# EAGLE design CarPreamp (EAGLE 7.6.0)
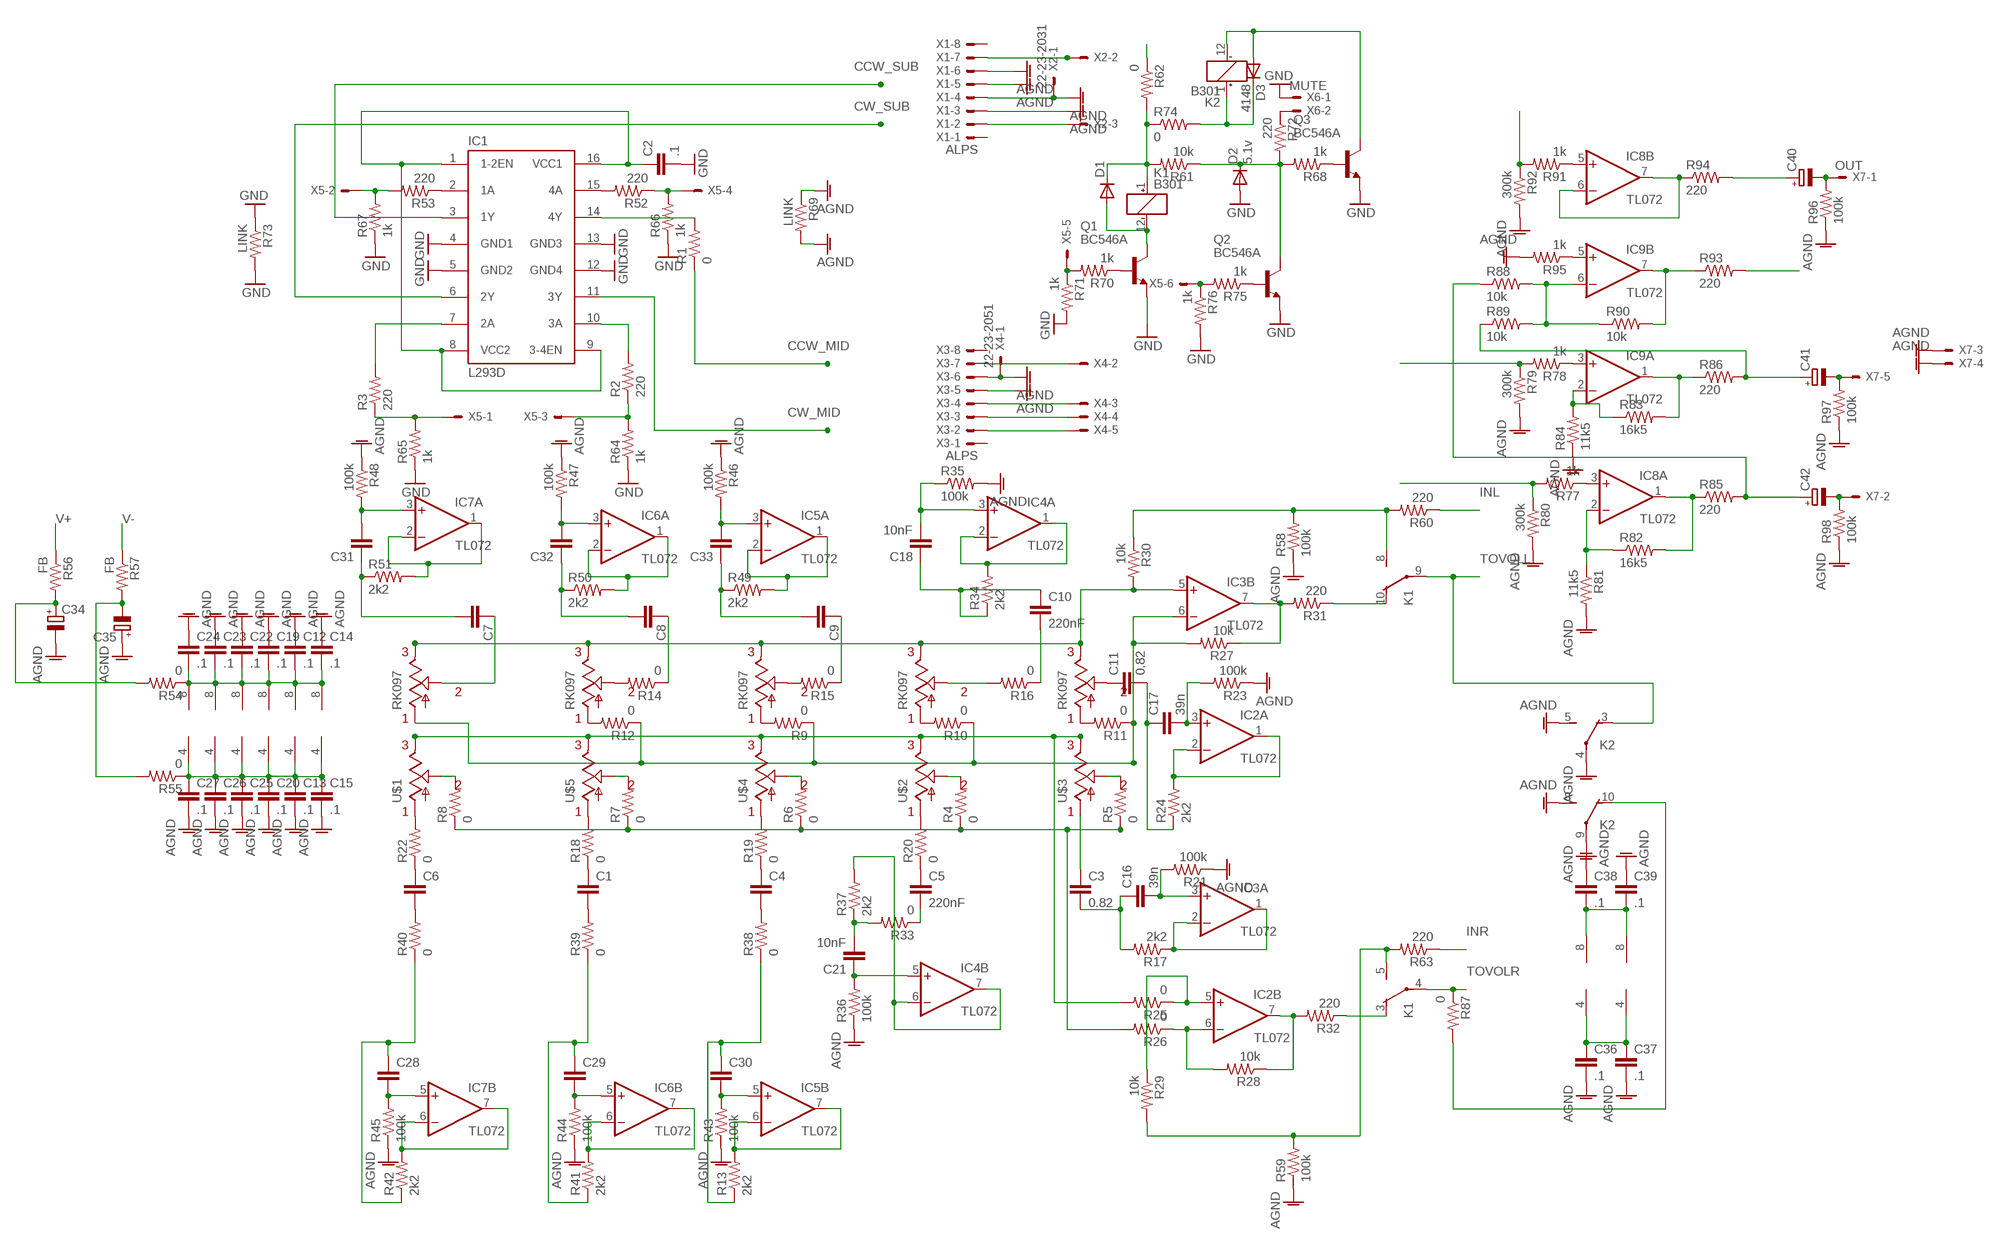
[diagram p0: schematic, sheet 1]

## Parts
C1  C-EU050-035X075  [C050-035X075]
C2  .1  C-EUC1210  [C1210]
C3  0.82  C-EU075-032X103  [C075-032X103]
C4  C-EU050-035X075  [C050-035X075]
C5  220nF  C-EU050-035X075  [C050-035X075]
C6  C-EU050-035X075  [C050-035X075]
C7  C-EU050-035X075  [C050-035X075]
C8  C-EU050-035X075  [C050-035X075]
C9  C-EU050-035X075  [C050-035X075]
C10  220nF  C-EU050-035X075  [C050-035X075]
C11  0.82  C-EU075-032X103  [C075-032X103]
C12  .1  C-EUC1210  [C1210]
C13  .1  C-EUC1210  [C1210]
C14  .1  C-EUC1210  [C1210]
C15  .1  C-EUC1210  [C1210]
C16  39n  C-EU050-035X075  [C050-035X075]
C17  39n  C-EU050-035X075  [C050-035X075]
C18  10nF  C-EU050-035X075  [C050-035X075]
C19  .1  C-EUC1210  [C1210]
C20  .1  C-EUC1210  [C1210]
C21  10nF  C-EU050-035X075  [C050-035X075]
C22  .1  C-EUC1210  [C1210]
C23  .1  C-EUC1210  [C1210]
C24  .1  C-EUC1210  [C1210]
C25  .1  C-EUC1210  [C1210]
C26  .1  C-EUC1210  [C1210]
C27  .1  C-EUC1210  [C1210]
C28  C-EU050-035X075  [C050-035X075]
C29  C-EU050-035X075  [C050-035X075]
C30  C-EU050-035X075  [C050-035X075]
C31  C-EU050-035X075  [C050-035X075]
C32  C-EU050-035X075  [C050-035X075]
C33  C-EU050-035X075  [C050-035X075]
C34  CPOL-EUE3.5-8  [E3,5-8]
C35  CPOL-EUE3.5-8  [E3,5-8]
C36  .1  C-EUC1210  [C1210]
C37  .1  C-EUC1210  [C1210]
C38  .1  C-EUC1210  [C1210]
C39  .1  C-EUC1210  [C1210]
C40  CPOL-EUE3.5-8  [E3,5-8]
C41  CPOL-EUE3.5-8  [E3,5-8]
C42  CPOL-EUE3.5-8  [E3,5-8]
D1  1N4148DO35-10  [DO35-10]
D2  5.1v  1N4148DO35-10  [DO35-10]
D3  4148  1N4148DO35-10  [DO35-10]
IC1  L293D  [DIL16]
IC2  TL072  LM1458N  [DIL08]
IC3  TL072  LM1458N  [DIL08]
IC4  TL072  LM1458N  [DIL08]
IC5  TL072  LM1458N  [DIL08]
IC6  TL072  LM1458N  [DIL08]
IC7  TL072  LM1458N  [DIL08]
IC8  TL072  LM1458N  [DIL08]
IC9  TL072  LM1458N  [DIL08]
K1  B301  TXD2-6V  [TXD2]
K2  B301  TXD2-6V  [TXD2]
Q1  BC546A  [TO92-EBC]
Q2  BC546A  [TO92-EBC]
Q3  BC546A  [TO92-EBC]
R1  0  R-US_0309/12  [0309/12]
R2  220  R-US_0309/12  [0309/12]
R3  220  R-US_0207/15  [0207/15]
R4  0  R-US_0207/7  [0207/7]
R5  0  R-US_0207/7  [0207/7]
R6  0  R-US_0207/7  [0207/7]
R7  0  R-US_0207/7  [0207/7]
R8  0  R-US_0207/7  [0207/7]
R9  0  R-US_0207/7  [0207/7]
R10  0  R-US_0207/7  [0207/7]
R11  0  R-US_0207/7  [0207/7]
R12  0  R-US_0207/7  [0207/7]
R13  2k2  R-US_0207/7  [0207/7]
R14  0  R-US_0207/7  [0207/7]
R15  0  R-US_0207/7  [0207/7]
R16  0  R-US_0207/7  [0207/7]
R17  2k2  R-US_0207/7  [0207/7]
R18  0  R-US_0207/7  [0207/7]
R19  0  R-US_0207/7  [0207/7]
R20  0  R-US_0207/7  [0207/7]
R21  100k  R-US_0207/7  [0207/7]
R22  0  R-US_0207/7  [0207/7]
R23  100k  R-US_0207/7  [0207/7]
R24  2k2  R-US_0207/7  [0207/7]
R25  0  R-US_0207/10  [0207/10]
R26  0  R-US_0207/12  [0207/12]
R27  10k  R-US_R1210  [R1210]
R28  10k  R-US_R1210  [R1210]
R29  10k  R-US_0207/7  [0207/7]
R30  10k  R-US_0207/12  [0207/12]
R31  220  R-US_0207/7  [0207/7]
R32  220  R-US_0207/12  [0207/12]
R33  0  R-US_0309/10  [0309/10]
R34  2k2  R-US_0207/7  [0207/7]
R35  100k  R-US_0207/7  [0207/7]
R36  100k  R-US_0207/7  [0207/7]
R37  2k2  R-US_0207/7  [0207/7]
R38  0  R-US_0207/10  [0207/10]
R39  0  R-US_0207/10  [0207/10]
R40  0  R-US_0207/10  [0207/10]
R41  2k2  R-US_0207/7  [0207/7]
R42  2k2  R-US_0207/7  [0207/7]
R43  100k  R-US_0207/7  [0207/7]
R44  100k  R-US_0207/7  [0207/7]
R45  100k  R-US_0207/7  [0207/7]
R46  100k  R-US_0207/7  [0207/7]
R47  100k  R-US_0207/7  [0207/7]
R48  100k  R-US_0207/7  [0207/7]
R49  2k2  R-US_0207/7  [0207/7]
R50  2k2  R-US_0207/7  [0207/7]
R51  2k2  R-US_0207/7  [0207/7]
R52  220  R-US_0309/10  [0309/10]
R53  220  R-US_0309/10  [0309/10]
R54  0  R-US_0309/10  [0309/10]
R55  0  R-US_0411/15  [0411/15]
R56  FB  R-US_0309/12  [0309/12]
R57  FB  R-US_0309/12  [0309/12]
R58  100k  R-US_0207/7  [0207/7]
R59  100k  R-US_0207/7  [0207/7]
R60  220  R-US_0207/7  [0207/7]
R61  10k  R-US_R1210  [R1210]
R62  0  R-US_0309/10  [0309/10]
R63  220  R-US_0207/7  [0207/7]
R64  1k  R-US_R1210  [R1210]
R65  1k  R-US_R1210  [R1210]
R66  1k  R-US_R1210  [R1210]
R67  1k  R-US_R1210  [R1210]
R68  1k  R-US_R1210  [R1210]
R69  LINK  R-US_0309/12  [0309/12]
R70  1k  R-US_R1210  [R1210]
R71  1k  R-US_R1210  [R1210]
R72  220  R-US_R1210  [R1210]
R73  LINK  R-US_0309/10  [0309/10]
R74  0  R-US_0309/12  [0309/12]
R75  1k  R-US_0309/10  [0309/10]
R76  1k  R-US_0309/10  [0309/10]
R77  1k  R-US_0207/7  [0207/7]
R78  1k  R-US_0207/7  [0207/7]
R79  300k  R-US_0207/7  [0207/7]
R80  300k  R-US_0207/7  [0207/7]
R81  11k5  R-US_0207/7  [0207/7]
R82  16k5  R-US_0207/7  [0207/7]
R83  16k5  R-US_0207/7  [0207/7]
R84  11k5  R-US_0207/7  [0207/7]
R85  220  R-US_0207/7  [0207/7]
R86  220  R-US_0207/7  [0207/7]
R87  0  R-US_0207/10  [0207/10]
R88  10k  R-US_0207/7  [0207/7]
R89  10k  R-US_0207/7  [0207/7]
R90  10k  R-US_0207/7  [0207/7]
R91  1k  R-US_0207/7  [0207/7]
R92  300k  R-US_0207/7  [0207/7]
R93  220  R-US_0207/7  [0207/7]
R94  220  R-US_0207/7  [0207/7]
R95  1k  R-US_0207/10  [0207/10]
R96  100k  R-US_0207/7  [0207/7]
R97  100k  R-US_0207/7  [0207/7]
R98  100k  R-US_0207/7  [0207/7]
U$1  RK097  RK097-DUAL-ELEMENT  [RK097-DUAL-ELEMENT]
U$2  RK097  RK097-DUAL-ELEMENT  [RK097-DUAL-ELEMENT]
U$3  RK097  RK097-DUAL-ELEMENT  [RK097-DUAL-ELEMENT]
U$4  RK097  RK097-DUAL-ELEMENT  [RK097-DUAL-ELEMENT]
U$5  RK097  RK097-DUAL-ELEMENT  [RK097-DUAL-ELEMENT]
X1  ALPS  22-23-2081  [22-23-2081]
X2  22-23-2031  [22-23-2031]
X3  ALPS  22-23-2081  [22-23-2081]
X4  22-23-2051  [22-23-2051]
X5  22-23-2061  [22-23-2061]
X6  MUTE  22-23-2021  [22-23-2021]
X7  OUT  22-23-2051  [22-23-2051]

## Nets
5V: C2.1 IC1.1(1-2EN) IC1.8(VCC2) IC1.9(3-4EN) IC1.16(VCC1) R62.1
AGND: C12.1 C13.2 C14.1 C15.2 C19.1 C20.2 C22.1 C23.1 C24.1 C25.2 C26.2 C27.2 C34.- C35.+ C36.2 C37.2 C38.1 C39.1 K2.4(P) K2.5(S) K2.8(S) K2.9(P) R21.1 R23.1 R35.2 R36.1 R43.1 R44.1 R45.1 R46.1 R47.1 R48.1 R58.1 R59.1 R69.1 R69.2 R79.2 R80.2 R81.2 R84.1 R92.2 R95.2 R96.1 R97.1 R98.1 X1.3 X1.4 X1.5 X1.6 X2.1 X3.5 X3.6 X4.1 X7.3 X7.4
CCW_MID: R1.1
CCW_SUB: IC1.3(1Y)
CW_MID: IC1.11(3Y)
CW_SUB: IC1.6(2Y)
GND: C2.2 D2.A IC1.4(GND1) IC1.5(GND2) IC1.12(GND4) IC1.13(GND3) Q1.E Q2.E Q3.E R64.1 R65.1 R66.1 R67.1 R71.2 R73.1 R73.2 R76.2 X6.1
INL: R60.1
INR: R63.1
N$2: IC1.14(4Y) R1.2
N$4: X3.2 X4.5
N$6: X3.3 X4.4
N$7: IC1.7(2A) R3.2
N$8: IC1.15(4A) R52.2
N$10: X1.2 X2.3
N$11: X1.7 X2.2
N$12: IC1.10(3A) R2.2
N$13: X3.7 X4.2
N$14: R25.2 U$1.P$4(E1) U$2.P$4(E1) U$3.P$4(E1) U$4.P$4(E1) U$5.P$4(E1)
N$15: IC3.5(B:+IN) R30.2 U$1.P$3(E) U$2.P$3(E) U$3.P$3(E) U$4.P$3(E) U$5.P$3(E)
N$16: X3.4 X4.3
N$17: R5.2 U$3.P$6(S1)
N$18: R6.2 U$4.P$6(S1)
N$19: R7.2 U$5.P$6(S1)
N$20: R8.2 U$1.P$6(S1)
N$21: R4.1 R5.1 R6.1 R7.1 R8.1 R26.2
N$22: R16.2 U$2.P$5(S)
N$23: R4.2 U$2.P$6(S1)
N$24: R9.2 U$4.P$1(A)
N$25: R10.2 U$2.P$1(A)
N$26: R11.2 U$3.P$1(A)
N$27: R12.2 U$5.P$1(A)
N$28: IC7.6(B:-IN) IC7.7(B:OUT) R42.2
N$29: IC3.6(B:-IN) R9.1 R10.1 R11.1 R12.1 R27.2 U$1.P$1(A)
N$30: R14.2 U$5.P$5(S)
N$31: R15.2 U$4.P$5(S)
N$32: C11.1 U$3.P$5(S)
N$33: R18.2 U$5.P$2(A1)
N$34: R19.2 U$4.P$2(A1)
N$35: R20.2 U$2.P$2(A1)
N$36: C3.1 U$3.P$2(A1)
N$37: R22.2 U$1.P$2(A1)
N$42: C1.1 R18.1
N$43: IC6.6(B:-IN) IC6.7(B:OUT) R41.2
N$44: C4.1 R19.1
N$45: C5.1 R20.1
N$46: C6.1 R22.1
N$47: C7.1 U$1.P$5(S)
N$48: C8.1 R14.1
N$49: C9.1 R15.1
N$50: C10.2 R16.1
N$51: IC5.6(B:-IN) IC5.7(B:OUT) R13.2
N$52: IC2.5(B:+IN) R25.1 R29.1
N$53: IC2.6(B:-IN) R26.1 R28.2
N$54: IC3.7(B:OUT) R27.1 R31.2
N$55: IC2.7(B:OUT) R28.1 R32.2
N$56: IC4.1(A:OUT) IC4.2(A:-IN) R34.2
N$57: C10.1 C18.1 R34.1
N$58: IC4.6(B:-IN) IC4.7(B:OUT) R37.2
N$59: IC2.1(A:OUT) IC2.2(A:-IN) R24.2
N$60: IC3.1(A:OUT) IC3.2(A:-IN) R17.1
N$61: C16.2 IC3.3(A:+IN) R21.2
N$62: C3.2 C16.1 R17.2
N$63: C17.2 IC2.3(A:+IN) R23.2
N$64: C11.2 C17.1 R24.1
N$65: C5.2 R33.1
N$66: C18.2 IC4.3(A:+IN) R35.1
N$67: C21.2 R33.2 R37.1
N$68: C21.1 IC4.5(B:+IN) R36.2
N$69: C12.2 C14.2 C19.2 C22.2 C23.2 C24.2 IC2.8(P:V+) IC3.8(P:V+) IC4.8(P:V+) IC5.8(P:V+) IC6.8(P:V+) IC7.8(P:V+) R54.1
N$70: C28.2 IC7.5(B:+IN) R45.2
N$71: C29.2 IC6.5(B:+IN) R44.2
N$72: C30.2 IC5.5(B:+IN) R43.2
N$73: C28.1 R40.1 R42.1
N$74: C13.1 C15.1 C20.1 C25.1 C26.1 C27.1 IC2.4(P:V-) IC3.4(P:V-) IC4.4(P:V-) IC5.4(P:V-) IC6.4(P:V-) IC7.4(P:V-) R55.1
N$75: C4.2 R38.2
N$76: C1.2 R39.2
N$77: C6.2 R40.2
N$78: C29.1 R39.1 R41.1
N$79: C30.1 R13.1 R38.1
N$80: IC7.1(A:OUT) IC7.2(A:-IN) R51.2
N$81: IC6.1(A:OUT) IC6.2(A:-IN) R50.2
N$82: IC5.1(A:OUT) IC5.2(A:-IN) R49.2
N$83: C7.2 C31.1 R51.1
N$84: C8.2 C32.1 R50.1
N$85: C9.2 C33.1 R49.1
N$86: C31.2 IC7.3(A:+IN) R48.2
N$87: C32.2 IC6.3(A:+IN) R47.2
N$88: C33.2 IC5.3(A:+IN) R46.2
N$89: IC1.2(1A) R53.1
N$90: Q1.B R70.1
N$91: R70.2 R71.1 X5.5
N$92: K1.10(O) R31.1
N$93: K1.8(S) R30.1 R58.2 R60.2
N$94: K1.5(S) R29.2 R59.2 R63.2
N$95: K1.3(O) R32.1
N$96: R3.1 R65.2 X5.1
N$97: R2.1 R64.2 X5.3
N$98: D1.C K1.1(_:+) R61.2 R62.2 R74.1
N$99: D1.A K1.12(_:-) Q1.C
N$100: R52.1 R66.2 X5.4
N$101: R53.2 R67.2 X5.2
N$104: D2.C Q2.C R61.1 R68.2 R72.2
N$105: Q2.B R75.1
N$106: R75.2 R76.1 X5.6
N$107: Q3.B R68.1
N$108: R72.1 X6.2
N$109: D3.C K2.1(_:+) R74.2
N$110: D3.A K2.12(_:-) Q3.C
N$111: C38.2 C39.2 IC8.8(P:V+) IC9.8(P:V+)
N$112: C36.1 C37.1 IC8.4(P:V-) IC9.4(P:V-)
N$113: IC9.1(A:OUT) R83.2 R86.1
N$114: IC8.1(A:OUT) R82.2 R85.1
N$115: IC8.6(B:-IN) IC8.7(B:OUT) R94.1
N$116: IC9.7(B:OUT) R90.2 R93.1
N$117: IC8.3(A:+IN) R77.1
N$118: IC9.3(A:+IN) R78.1
N$119: R78.2 R79.1
N$120: R77.2 R80.1
N$121: IC9.2(A:-IN) R83.1 R84.2
N$122: IC8.2(A:-IN) R81.1 R82.1
N$123: IC9.6(B:-IN) R88.2 R89.2 R90.1
N$124: K2.10(O) R87.2
N$125: IC8.5(B:+IN) R91.1
N$126: R91.2 R92.1
N$127: IC9.5(B:+IN) R95.1
N$128: C41.+ R86.2 R89.1
N$129: C42.+ R85.2 R88.1
N$130: C40.+ R94.2
N$131: R93.2
N$132: C40.- R96.2 X7.1
N$133: C41.- R97.2 X7.5
N$134: C42.- R98.2 X7.2
TOVOLL: K1.9(P) K2.3(O)
TOVOLR: K1.4(P) R87.1
V+: R56.1
V++: C34.+ R54.2 R56.2
V-: R57.1
V--: C35.- R55.2 R57.2
Unconnected: X1.1 X1.8 X3.1 X3.8

## Library data of the parts
C1-C33 C36-C39 = resistor:C-EU: CAPACITOR, European symbol
C34 C35 C40-C42 = resistor:CPOL-EU: POLARIZED CAPACITOR, European symbol
D1-D3 = diode:1N4148: DIODE high speed (Philips)
IC1 = st-microelectronics:L293D: PUSH-PULL 4 CHANNEL DRIVER; MPN: L293D; OC_FARNELL: 9589619; OC_NEWARK: 56P8249
IC2-IC9 = linear:*1458: OP AMP
K1 K2 = relay:TX?-*: TX Relais NAiS TX-D RELAYS HIGH INSULATION Conforming to the supplementary insulation class of EN Standards (EN41003) Source: http://www.mew-europe.com/.. en_ds_61022_0007.pdf TX-S RELAYS SMALL POLARIZED RELAY WITH HIGH SENSITIVITY 50mW Source: http://www.mew-europe.com/.. en_ds_61022_0022.pdf; OC_FARNELL: unknown; OC_NEWARK: unknown
Q1-Q3 = transistor-npn:BC546*: NPN Transistor
R1-R98 = resistor:R-US_: RESISTOR, American symbol
U$1-U$5 = alps_japan_potentiometers:RK097-DUAL-ELEMENT: SCHEMATIC FOR DUAL POTENTIOMETER
X1 X3 = con-molex:22-23-2081: .100" (2.54mm) Center Header - 8 Pin; MF: MOLEX; MPN: 22-23-2081; OC_FARNELL: 1756826; OC_NEWARK: 01C7592
X2 = con-molex:22-23-2031: .100" (2.54mm) Center Header - 3 Pin; MF: MOLEX; MPN: 22-23-2031; OC_FARNELL: 1462950; OC_NEWARK: 30C0862
X4 X7 = con-molex:22-23-2051: .100" (2.54mm) Center Header - 5 Pin; MF: MOLEX; MPN: 22-23-2051; OC_FARNELL: 1462952; OC_NEWARK: 38C9178
X5 = con-molex:22-23-2061: .100" (2.54mm) Center Header - 6 Pin; MF: MOLEX; MPN: 22-23-2061; OC_FARNELL: 1462922; OC_NEWARK: 27C1933
X6 = con-molex:22-23-2021: .100" (2.54mm) Center Header - 2 Pin; MF: MOLEX; MPN: 22-23-2021; OC_FARNELL: 1462926; OC_NEWARK: 25C3832

## Board
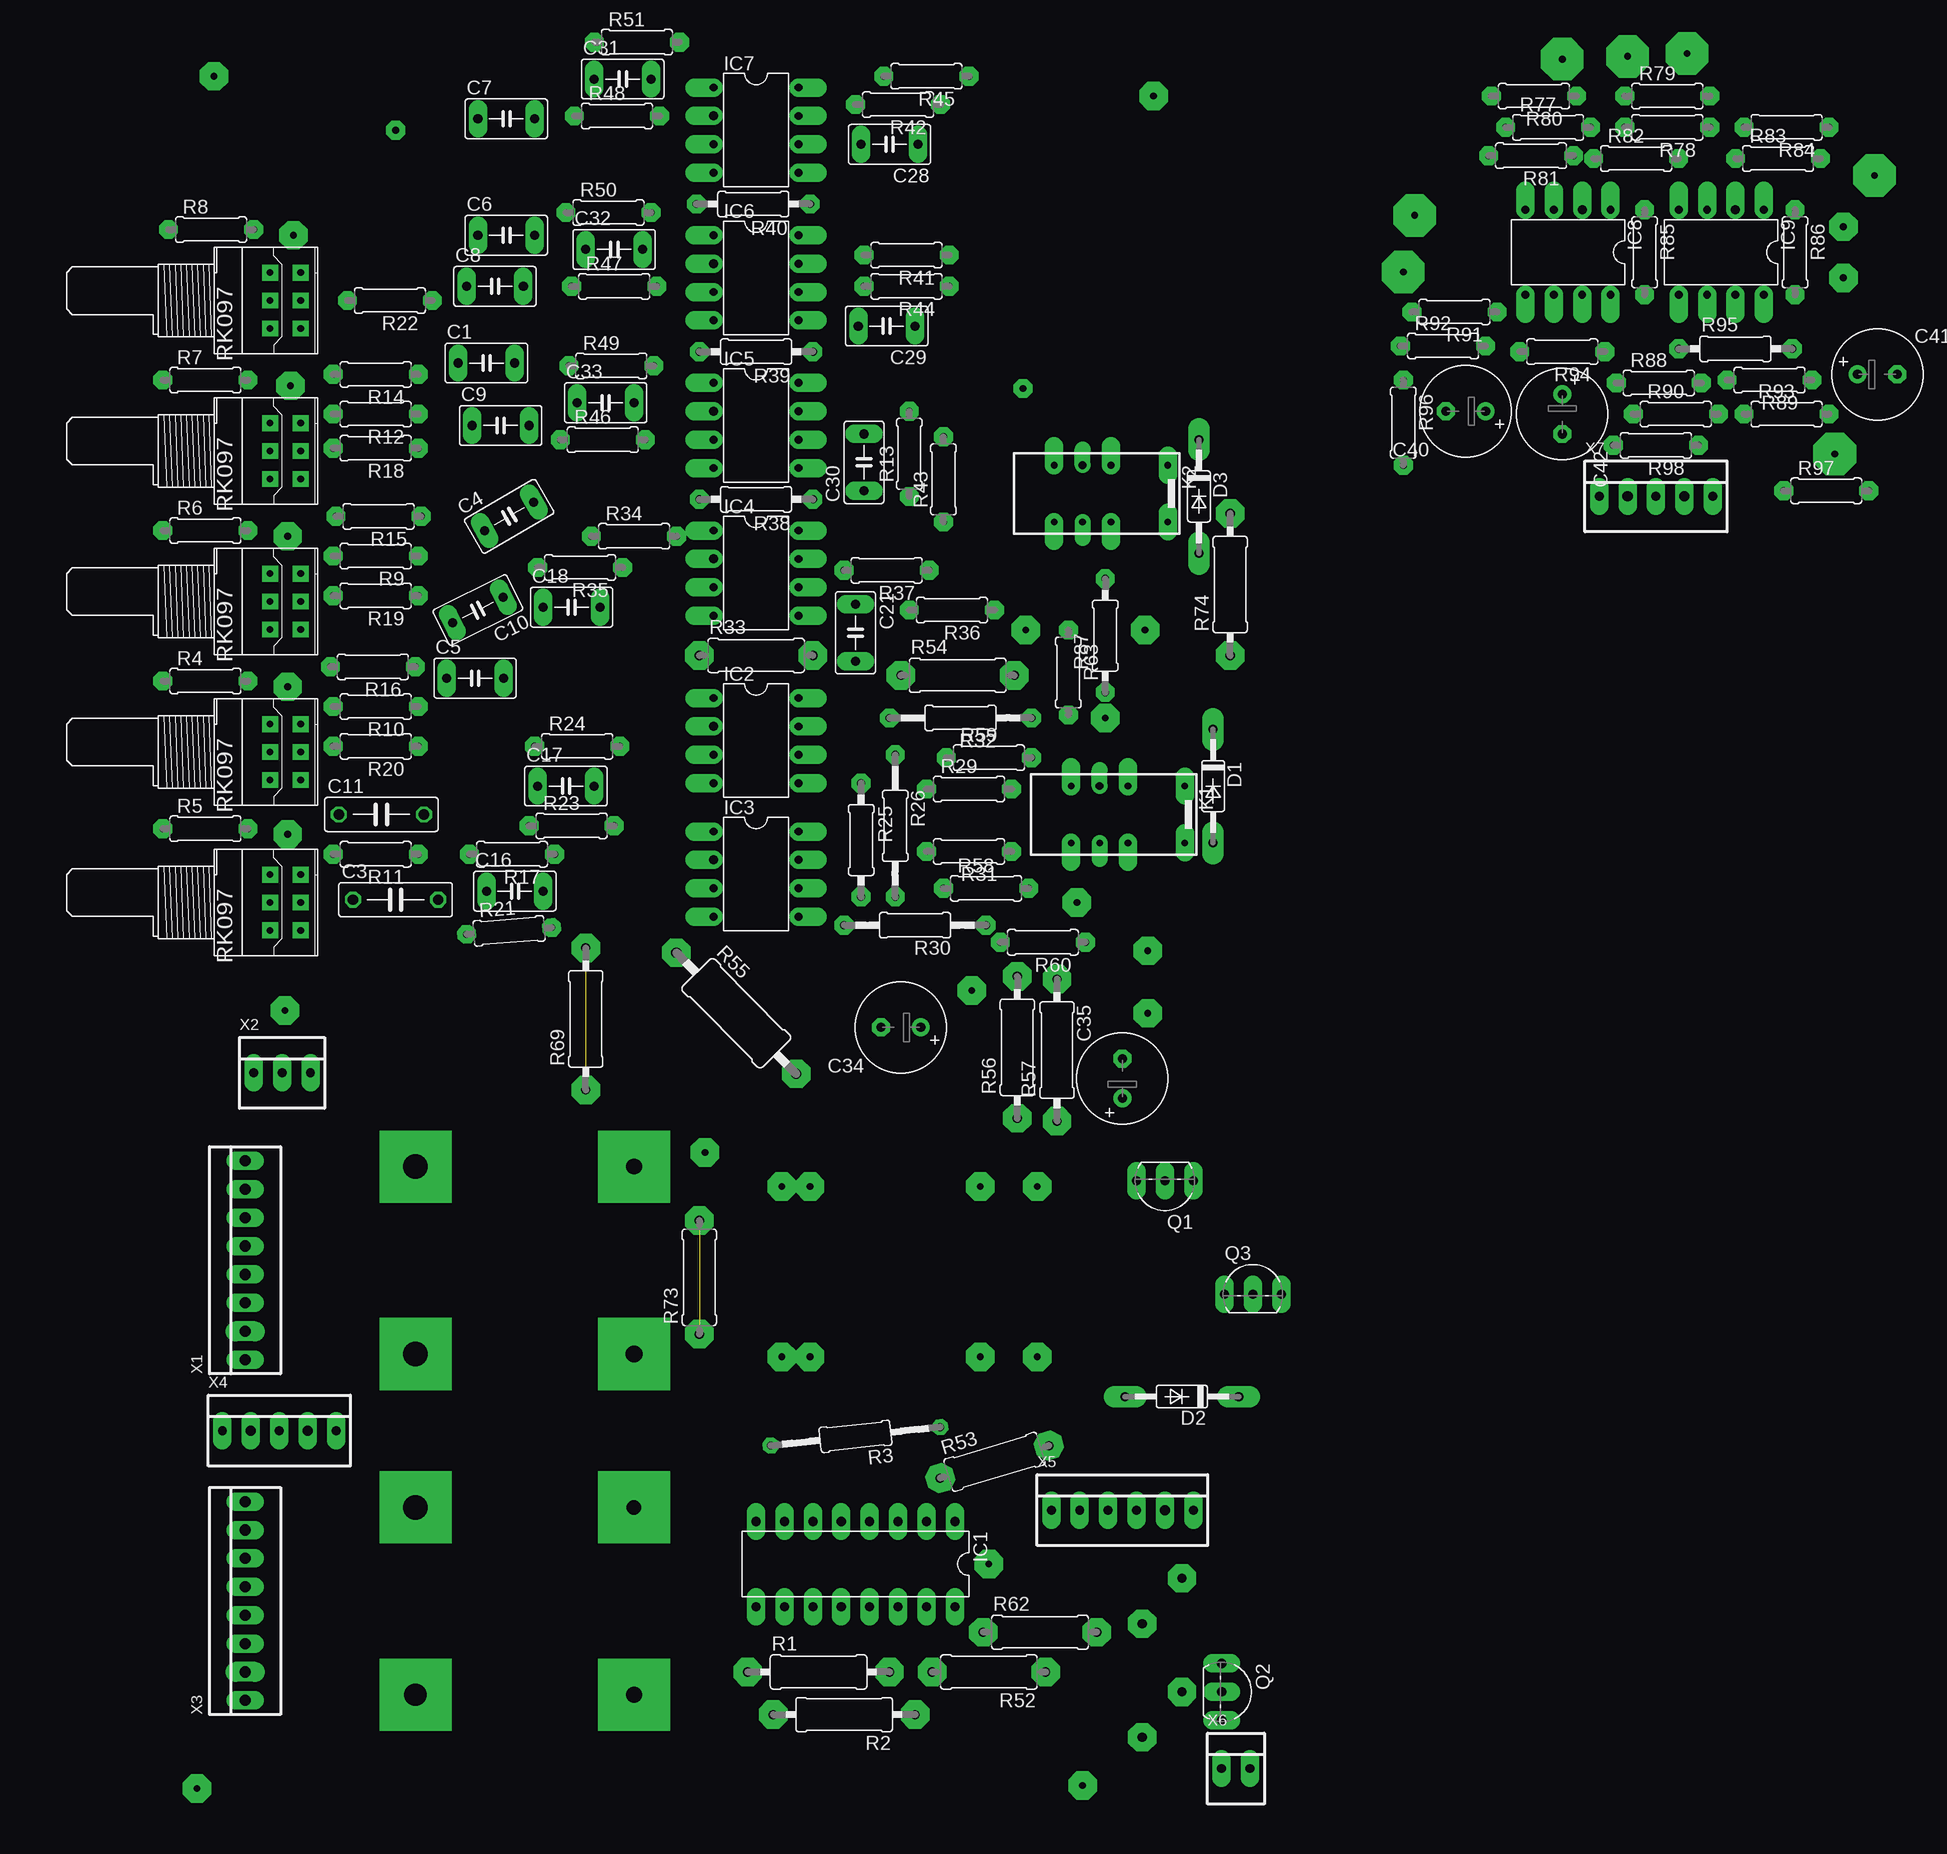
[diagram p1: board, top side]
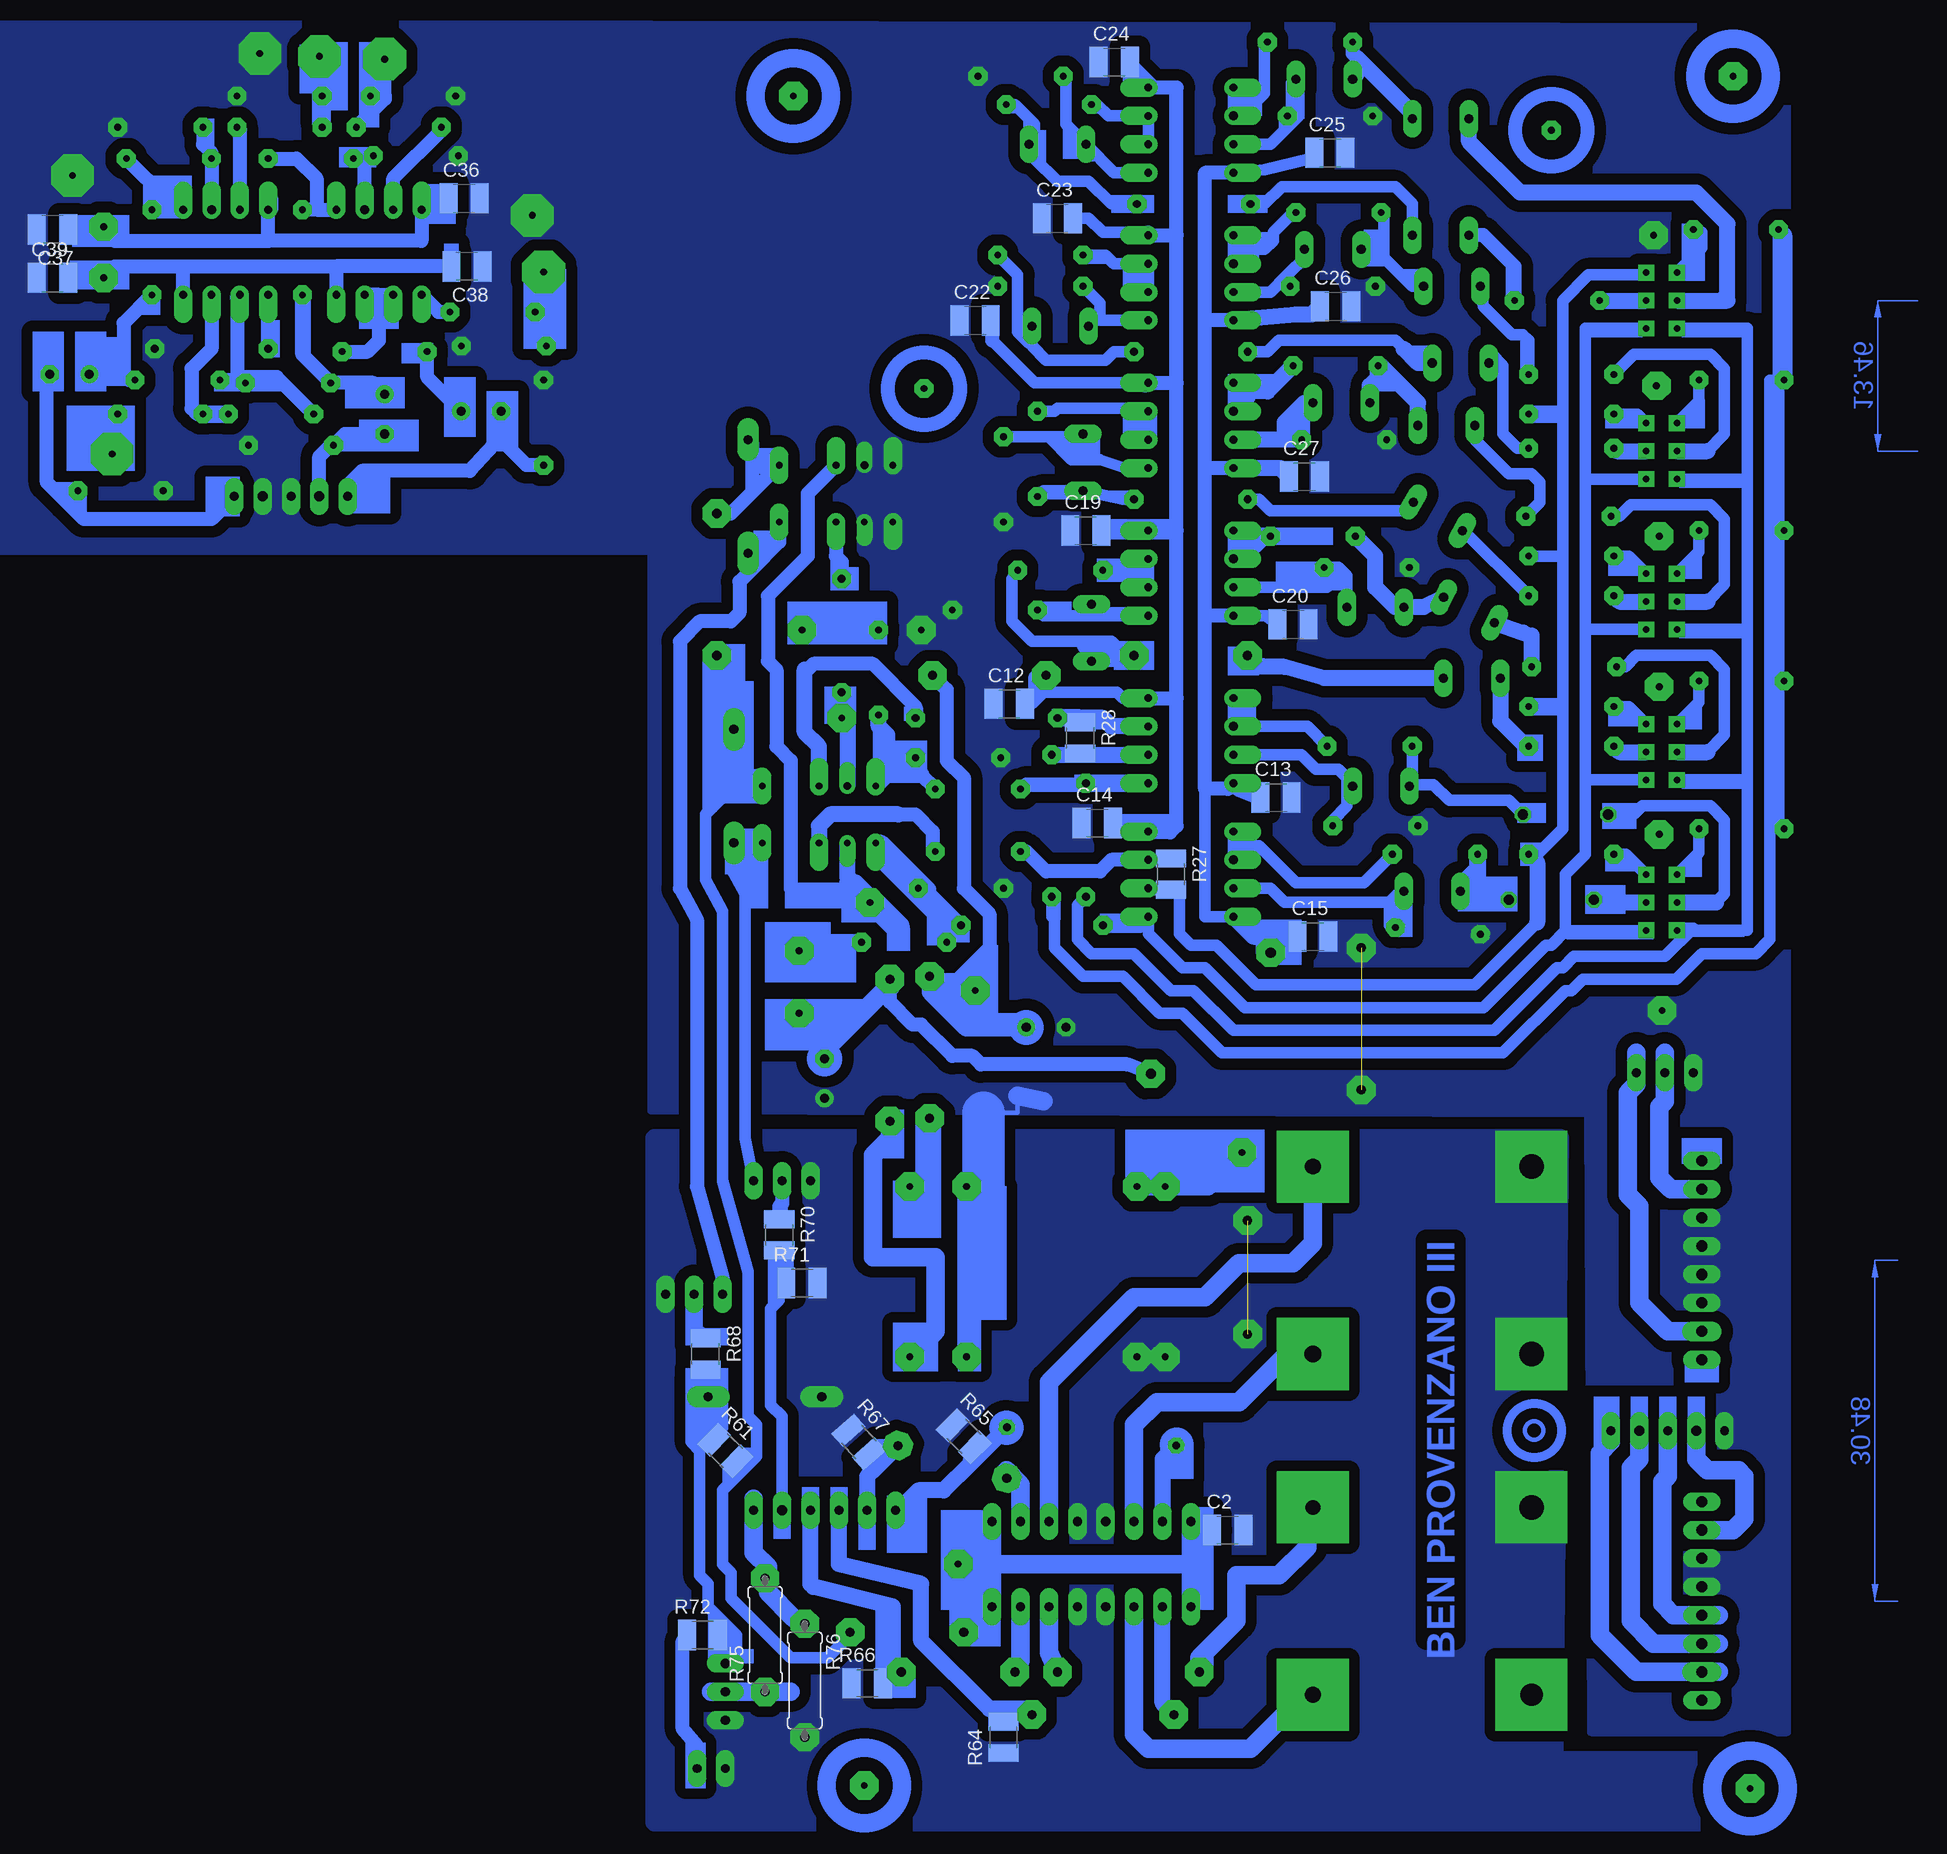
[diagram p2: board, bottom side, seen from below]

No outline drawn. Coordinates in mm, seen from the top.
Copper layers (1*16): Top 0.035mm / dielectric 1.5mm / Bottom 0.035mm
Design rules "default": minimum track width 10mil, minimum drill 24mil, track to track 8mil, track to pad 8mil, pad to pad 8mil, via to via 8mil, smd to smd 8mil, copper to edge 40mil, drill to drill 8mil, minimum pad ring 10mil, minimum via ring 8mil, stop-mask expansion 4mil, vias tented up to drill 0mil, thermal gap 10mil

### Footprints (pad centres in the part's own frame; a part is rotated, then mirrored left to right if it is on the bottom)
C050-035X075 = drill 0.813 pad 1.676 long: 1 -2.54,0; 2 2.54,0
C1210 = smd 1.6 x 2.7: 1 -1.4,0; 2 1.4,0
C075-032X103 = drill 0.914 octagon: 1 -3.81,0; 2 3.81,0
E3,5-8 = drill 0.813 pad 1.6: + -1.778,0 | drill 0.813 pad 1.6 octagon: - 1.778,0
DO35-10 = drill 0.813 pad 1.93 long: A 5.08,0; C -5.08,0
DIL16 = drill 0.813 pad 1.676 long: 1 -8.89,-3.81; 2 -6.35,-3.81; 3 -3.81,-3.81; 4 -1.27,-3.81; 5 1.27,-3.81; 6 3.81,-3.81; 7 6.35,-3.81; 8 8.89,-3.81; 9 8.89,3.81; 10 6.35,3.81; 11 3.81,3.81; 12 1.27,3.81; 13 -1.27,3.81; 14 -3.81,3.81; 15 -6.35,3.81; 16 -8.89,3.81
DIL08 = drill 0.7 pad 1.676 offset: 1 -3.81,-3.81; 3 1.27,-3.81; 4 3.81,-3.81; 5 3.81,3.81; 6 1.27,3.81; 7 -1.27,3.81; 8 -3.81,3.81 | drill 0.8 pad 1.676 offset: 2 -1.27,-3.81
TXD2 = drill 0.6 pad 1.676 long: 1 -6.35,-2.54; 12 -6.35,2.54 | drill 0.6 pad 1.676 offset: 3 -1.27,-2.54; 5 3.81,-2.54; 8 3.81,2.54; 10 -1.27,2.54 | drill 0.7 pad 1.422 offset: 4 1.27,-2.54 | drill 0.6 pad 1.422 offset: 9 1.27,2.54
TO92-EBC = drill 0.813 pad 1.676 long: B 0,-1.27; C -2.54,-1.27; E 2.54,-1.27
0309/12 = drill 0.813 pad 2.54 octagon: 1 -6.35,0; 2 6.35,0
0207/15 = drill 0.7 pad 1.422 octagon: 1 -7.62,0; 2 7.62,0
0207/7 = drill 0.6 pad 1.676 octagon: 1 -3.81,0; 2 3.81,0
0207/10 = drill 0.7 pad 1.676 octagon: 1 -5.08,0; 2 5.08,0
0207/12 = drill 0.7 pad 1.676 octagon: 1 -6.35,0; 2 6.35,0
R1210 = smd 1.6 x 2.7: 1 -1.4,0; 2 1.4,0
0309/10 = drill 0.813 pad 2.54 octagon: 1 -5.08,0; 2 5.08,0
0411/15 = drill 0.914 pad 2.54 octagon: 1 -7.62,0; 2 7.62,0
RK097-DUAL-ELEMENT = drill 0.6 pad 1.422 square: P$1 -2.5,2.69; P$2 0,2.69; P$3 2.5,2.69; P$4 2.5,-0.06; P$5 0,-0.06; P$6 -2.5,-0.06
22-23-2081 = drill 1 pad 1.676 long: 1 -8.89,0; 3 -3.81,0; 4 -1.27,0; 5 1.27,0; 6 3.81,0; 7 6.35,0; 8 8.89,0 | drill 1 pad 1.778 long: 2 -6.35,0
22-23-2031 = drill 0.8 pad 1.676 long: 1 -2.54,0; 2 0,0; 3 2.54,0
22-23-2051 = drill 0.8 pad 1.676 long: 1 -5.08,0; 3 0,0; 5 5.08,0 | drill 0.9 pad 1.676 long: 2 -2.54,0; 4 2.54,0
22-23-2061 = drill 0.8 pad 1.676 long: 1 -6.35,0; 2 -3.81,0; 3 -1.27,0; 4 1.27,0; 6 6.35,0 | drill 0.9 pad 1.676 long: 5 3.81,0
22-23-2021 = drill 0.8 pad 1.676 long: 1 -1.27,0; 2 1.27,0

### Placement (x,y rotation side)
C1  27.69,-69.6 0 top
C2  48.51,-173.99 0 bottom
C3  19.56,-117.6 0 top
C4  29.72,-83.31 30.1 top
C5  26.67,-97.79 0 top
C6  29.46,-58.17 0 top
C7  29.46,-47.75 0 top
C8  28.45,-62.74 0 top
C9  28.96,-75.18 0 top
C10  26.92,-91.69 206.5 top
C11  18.29,-109.98 0 top
C12  68.07,-100.08 0 bottom
C13  44.2,-108.46 0 bottom
C14  60.2,-110.74 0 bottom
C15  40.89,-120.9 0 bottom
C16  30.23,-116.84 0 top
C17  34.8,-107.44 0 top
C18  35.31,-91.44 0 top
C19  61.21,-84.58 0 bottom
C20  42.67,-92.96 0 bottom
C21  60.71,-93.73 270 top
C22  71.12,-65.79 0 bottom
C23  63.75,-56.64 0 bottom
C24  58.67,-42.67 0 bottom
C25  39.37,-50.8 0 bottom
C26  38.86,-64.52 0 bottom
C27  41.66,-79.76 0 bottom
C28  63.75,-50.04 180 top
C29  63.5,-66.29 180 top
C30  61.47,-78.49 90 top
C31  39.88,-44.2 0 top
C32  39.12,-59.44 0 top
C33  38.35,-73.15 0 top
C34  64.77,-129.03 180 top
C35  84.58,-133.6 90 top
C36  116.84,-54.86 0 bottom
C37  153.67,-57.66 180 bottom
C38  116.59,-60.96 180 bottom
C39  153.67,-61.98 0 bottom
C40  115.32,-73.91 180 top
C41  152.15,-70.61 0 top
C42  123.95,-74.17 270 top
D1  92.71,-107.44 270 top
D2  89.92,-162.05 180 top
D3  91.44,-81.53 270 top
IC1  60.71,-177.04 180 top
IC2  51.82,-103.38 270 top
IC3  51.82,-115.32 270 top
IC4  51.82,-88.39 270 top
IC5  51.82,-75.18 270 top
IC6  51.82,-61.98 270 top
IC7  51.82,-48.77 270 top
IC8  124.46,-59.69 180 top
IC9  138.18,-59.69 180 top
K1  83.82,-109.98 180 top
K2  82.3,-81.28 180 top
Q1  88.39,-144.02 180 top
Q2  94.74,-188.47 270 top
Q3  96.27,-151.64 0 top
R1  57.4,-186.69 0 top
R2  59.69,-190.5 180 top
R3  60.71,-165.61 186.2 top
R4  2.54,-98.04 0 top
R5  2.54,-111.25 0 top
R6  2.54,-84.58 0 top
R7  2.54,-71.12 0 top
R8  3.05,-57.66 0 top
R9  17.78,-86.87 180 top
R10  17.78,-100.33 180 top
R11  17.78,-113.54 180 top
R12  17.78,-74.17 180 top
R13  65.53,-77.72 90 top
R14  17.78,-70.61 180 top
R15  18.03,-83.31 180 top
R16  17.53,-96.77 180 top
R17  29.97,-113.54 180 top
R18  17.78,-77.22 180 top
R19  17.78,-90.42 180 top
R20  17.78,-103.89 180 top
R21  29.72,-120.4 4.4 top
R22  19.05,-64.01 180 top
R23  35.31,-111 0 top
R24  35.81,-103.89 0 top
R25  61.21,-112.27 270 top
R26  64.26,-111 270 top
R27  53.59,-115.32 270 bottom
R28  61.72,-103.12 270 bottom
R29  70.87,-107.7 0 top
R30  66.04,-119.89 180 top
R31  70.87,-113.28 180 top
R32  70.1,-101.35 180 top
R33  51.82,-95.76 0 top
R34  40.89,-85.09 0 top
R35  36.07,-87.88 180 top
R36  69.34,-91.69 180 top
R37  63.5,-88.14 180 top
R38  51.82,-81.79 180 top
R39  51.82,-68.58 180 top
R40  51.56,-55.37 180 top
R41  65.28,-59.94 180 top
R42  64.52,-46.48 180 top
R43  68.58,-80.01 90 top
R44  65.28,-62.74 180 top
R45  67.06,-43.94 180 top
R46  38.1,-76.45 0 top
R47  39.12,-62.74 0 top
R48  39.37,-47.5 0 top
R49  38.86,-69.85 0 top
R50  38.61,-56.13 0 top
R51  41.15,-40.89 0 top
R52  72.64,-186.69 180 top
R53  73.15,-167.89 16.7 top
R54  69.85,-97.54 0 top
R55  50.04,-127.76 314.7 top
R56  75.18,-130.81 90 top
R57  78.74,-131.06 90 top
R58  72.39,-116.59 0 top
R59  72.64,-104.9 0 top
R60  77.47,-121.41 180 top
R61  93.47,-166.88 315.6 bottom
R62  77.22,-183.13 0 top
R63  79.76,-97.28 270 top
R64  68.58,-192.53 90 bottom
R65  72.14,-165.61 315 bottom
R66  80.77,-187.71 0 bottom
R67  81.53,-166.12 311.4 bottom
R68  95.25,-158.24 270 bottom
R69  36.58,-128.27 90 top
R70  88.65,-147.57 270 bottom
R71  86.61,-151.89 0 bottom
R72  95.5,-183.39 0 bottom
R73  46.74,-151.38 90 top
R74  94.23,-89.41 90 top
R75  89.92,-183.39 90 bottom
R76  86.36,-187.45 270 bottom
R77  122.68,-48.51 0 top
R78  133.35,-48.51 180 top
R79  133.35,-45.72 0 top
R80  121.41,-45.72 180 top
R81  121.16,-51.05 180 top
R82  130.56,-51.31 0 top
R83  143.26,-51.31 0 top
R84  144.02,-48.51 180 top
R85  131.32,-59.69 270 top
R86  144.78,-59.69 270 top
R87  83.06,-93.98 90 top
R88  132.59,-71.37 0 top
R89  142.49,-71.12 180 top
R90  134.11,-74.17 0 top
R91  114.3,-65.02 180 top
R92  113.28,-68.07 0 top
R93  144.02,-74.17 0 top
R94  123.95,-68.58 180 top
R95  139.45,-68.33 0 top
R96  109.73,-74.93 270 top
R97  147.57,-81.03 0 top
R98  132.33,-76.96 180 top
U$1  8.38,-64.01 270 top
U$2  8.38,-104.39 270 top
U$3  8.38,-117.86 270 top
U$4  8.38,-90.93 270 top
U$5  8.38,-77.47 270 top
X1  6.1,-149.86 90 top
X2  9.4,-133.1 0 top
X3  6.1,-180.34 90 top
X4  9.14,-165.1 0 top
X5  84.58,-172.21 0 top
X6  94.74,-195.33 0 top
X7  132.33,-81.53 0 top

### Tracks (layer width: path | path; a pad name or v marks a point on that pad's centre or on a via)
5V  (via drill 0.6 pad 2.54)
  Bottom 1.27: v72.64,-177.04 71.37,-177.29 69.6,-177.29
  Bottom 1.422: R62.1 IC1.16
  Bottom 1.676: IC1.9 51.82,-177.04 | IC1.1 69.6,-177.04 | 69.6,-177.04 69.6,-177.29 IC1.16 | IC1.8 51.82,-177.04 | 51.82,-177.04 69.6,-177.04 | C2.1 51.82,-177.04
AGND  (via drill 0.6 pad 2.54, 0.6 pad 3.81)  (1 unrouted)
  Bottom 0.406: 70.36,-136.65 67.31,-136.65 67.31,-135.13
  Bottom 1.676: v71.88,-158.5 v71.88,-143.26 71.37,-143.26 70.87,-143.76 | 67.31,-135.13 65.02,-135.64
  Bottom 3.81: 70.87,-143.76 70.36,-143.26 70.36,-136.65
  other vias: 10.41,-58.17 9.65,-127.51 75.95,-93.47 110.74,-56.39 135.13,-41.91 151.89,-52.83
  pour Bottom (isolate 1.016, no thermals): 100.08,-39.37 164.85,-39.37 164.85,-86.36 100.08,-86.36 100.08,-136.4 16.26,-136.65 16,-192.02 -1.52,-192.02 -1.52,-39.62
CCW_MID  (via drill 1.3 pad 6.45)
  Bottom 1.676: v40.89,-171.96 41.4,-172.47 41.4,-175.51 43.94,-178.05 47.75,-178.05 47.75,-182.12 51.05,-185.42 R1.1
CCW_SUB  (via drill 1.4 pad 6.45)
  Bottom 1.27: 40.89,-142.24 v40.89,-141.48
  Bottom 1.676: IC1.3 64.52,-160.78 56.9,-153.16 50.55,-153.16 47.5,-150.11 42.67,-150.11 40.89,-148.34 40.89,-142.24
CW_MID  (via drill 1.4 pad 6.45)
  Bottom 1.676: IC1.11 56.9,-192.28 55.63,-193.55 46.48,-193.55 41.66,-188.72 v40.89,-188.72
CW_SUB  (via drill 1.5 pad 6.45)
  Bottom 1.422: 40.89,-158.75 v40.89,-158.24 41.91,-159.26
  Bottom 1.676: IC1.6 56.9,-164.59 54.86,-162.56 47.5,-162.56 43.18,-158.24 v40.89,-158.24
GND  (via drill 0.6 pad 2.54, 2.2 pad 6.45)  (1 unrouted)
  other vias: 21.34,-141.48 21.34,-158.24 21.34,-171.96 21.34,-171.96 56.64,-158.5 54.1,-158.5
  pour Bottom (isolate 0.965, no thermals): 18.8,-138.94 99.82,-138.94 99.82,-200.15 -1.52,-200.15 -1.52,-194.56 19.3,-194.56 19.3,-194.06 19.05,-169.16 21.08,-169.16 21.08,-160.78 19.05,-160.78
INL  (via drill 0.6 pad 2.54)
  Bottom 1.422: R60.1 84.84,-121.41 85.6,-122.17 v86.87,-122.17
INR  (via drill 0.6 pad 2.54)
  Bottom 1.422: v86.61,-93.47 R63.1
N$1  (via drill 0.6 pad 2.54)
  other vias: 1.78,-197.1
N$2
  Bottom 1.676: R1.2 64.52,-184.91 IC1.14
N$3  (via drill 2 pad 6.45)
  other vias: 21.34,-188.72
N$4
  Bottom 1.676: 4.57,-186.69 X3.2 11.94,-186.69 15.24,-183.39 15.24,-167.13 14.22,-166.12 X4.5
N$5  (via drill 0.6 pad 2.54)
  other vias: 3.3,-43.94
N$6
  Bottom 1.676: X4.4 11.68,-167.64 12.45,-168.4 12.45,-182.12 10.41,-184.15 X3.3 4.57,-184.15
N$7
  Bottom 1.422: R3.2 54.36,-167.64 IC1.7
N$8
  Bottom 1.676: R52.2 67.06,-185.67 IC1.15
N$9  (via drill 0.6 pad 2.54)
  Bottom 1.676: v47.24,-140.21 50.29,-143.26 v54.1,-143.26 v56.64,-143.26
N$10
  Bottom 1.676: 11.94,-131.32 X2.3 11.94,-134.11 12.7,-134.87 12.7,-144.02 11.68,-145.03 11.68,-153.67 9.14,-156.21 X1.2
N$11
  Bottom 1.676: 9.4,-131.32 X2.2 9.4,-135.64 9.91,-136.14 9.91,-142.49 8.89,-143.51 X1.7
N$12
  Bottom 1.422: R2.2 54.36,-189.48 IC1.10
N$13
  Bottom 1.676: X4.2 6.6,-167.64 5.59,-168.66 2.79,-168.66 2.29,-169.16 2.29,-172.97 3.3,-173.99 X3.7
N$14
  Bottom 1.016: U$1.P$4 2.03,-66.51 2.03,-80.01 | 2.03,-80.01 8.32,-80.01 U$5.P$4 | 2.03,-106.89 2.03,-120.36 U$3.P$4 8.28,-120.14 6.86,-120.14 9.4,-122.68 17.53,-122.68 18.54,-123.7 19.05,-123.7 24.64,-129.29 48.01,-129.29 51.56,-125.73 53.59,-125.73 56.9,-122.43 60.71,-122.43 61.98,-121.16 61.98,-118.11 R25.2 | 2.03,-106.89 2.03,-93.43 | 2.03,-93.43 2.03,-80.01 | U$4.P$4 2.03,-93.43 | U$2.P$4 2.03,-106.89
N$15
  Bottom 1.016: U$1.P$3 16.51,-66.51 16.51,-80.01 | 16.51,-80.01 11.07,-80.01 U$5.P$3 | 16.51,-106.89 16.51,-93.43 | 16.51,-93.43 16.51,-80.01 | U$4.P$3 16.51,-93.43 | U$2.P$3 16.51,-106.89 | U$3.P$3 11.62,-120.65 18.03,-120.65 18.29,-120.4 | 18.29,-120.4 18.29,-115.32 16.51,-113.54 16.51,-106.89 | 18.29,-120.4 19.56,-121.67 20.07,-121.67 25.65,-127.25 46.99,-127.25 50.55,-123.7 52.58,-123.7 55.63,-120.65 IC3.5
  Bottom 1.422: IC3.5 56.39,-119.89 R30.2
N$16
  Bottom 1.676: 4.57,-181.61 X3.4 8.64,-181.61 9.65,-180.59 9.65,-169.67 9.14,-169.16 X4.3
N$17
  Bottom 1.016: U$3.P$6 6.35,-113.38 R5.2
N$18
  Bottom 1.016: U$4.P$6 6.35,-86.46 R6.2
N$19
  Bottom 1.016: U$5.P$6 6.35,-73 R7.2
N$20
  Bottom 1.016: U$1.P$6 6.1,-59.28 6.1,-57.91 6.35,-57.66 R8.2
N$21
  Bottom 1.016: R5.1 0,-109.98 | 0,-109.98 0,-99.31 | R4.1 0,-99.31 | 0,-99.31 0,-84.58 | 0,-84.58 0,-71.12 R7.1 | R6.1 0,-84.58 | R26.2 64.26,-119.13 64.01,-119.38 64.01,-121.92 61.47,-124.46 57.91,-124.46 54.61,-127.76 52.58,-127.76 49.02,-131.32 23.88,-131.32 18.29,-125.73 17.78,-125.73 16.76,-124.71 8.38,-124.71 6.1,-122.43 1.27,-122.43 0,-121.16 0,-109.98
  Bottom 1.422: R8.1 -1.27,-58.17 R7.1
N$22
  Bottom 1.016: 5.59,-104.39 4.06,-102.87 4.06,-97.03 5.33,-95.76 11.94,-95.76 12.95,-96.77 R16.2
  Bottom 1.422: U$2.P$5 5.59,-104.39
N$23
  Bottom 1.016: U$2.P$6 6.35,-99.92 R4.2
N$24
  Bottom 1.016: U$4.P$1 12.64,-86.87 R9.2
N$25
  Bottom 1.016: U$2.P$1 12.64,-100.33 R10.2
N$26
  Bottom 1.016: U$3.P$1 12.89,-113.54 R11.2
N$27
  Bottom 1.016: U$5.P$1 11.87,-74.17 R12.2
N$28
  Bottom 1.016: IC7.6 IC7.7 59.18,-47.5 60.2,-46.48 R42.2
N$29
  Bottom 1.016: 18.54,-74.17 18.54,-86.87 | 18.54,-86.87 18.54,-100.33 | 18.54,-100.33 18.54,-111.25 20.83,-113.54 R11.1 | R10.1 18.54,-100.33 | R9.1 18.54,-86.87 | R12.1 18.54,-74.17 | U$1.P$1 11.29,-61.72 16.26,-61.72 18.54,-64.01 18.54,-74.17 | 20.83,-119.63 26.42,-125.22 45.97,-125.22 49.53,-121.67 51.82,-121.67 52.83,-120.65 52.83,-116.59 IC3.6 55.5,-116.72 R27.2
  Bottom 1.422: R11.1 20.83,-114.3 20.83,-119.63
N$30
  Bottom 1.016: 5.59,-77.47 4.06,-75.95 4.06,-70.1 5.33,-68.83 12.19,-68.83 R14.2
  Bottom 1.422: U$5.P$5 5.59,-77.47
N$31
  Bottom 1.016: 5.59,-90.93 4.06,-89.41 4.06,-83.57 5.33,-82.3 12.45,-82.3 13.46,-83.31 R15.2
  Bottom 1.422: U$4.P$5 5.59,-90.93
N$32
  Bottom 1.016: 4.83,-117.86 4.06,-117.09 4.06,-110.49 5.33,-109.22 11.43,-109.22 12.19,-109.98 C11.1
  Bottom 1.422: U$3.P$5 4.83,-117.86
N$33
  Bottom 1.422: R18.2 13.72,-77.47 U$5.P$2
N$34
  Bottom 1.422: R19.2 13.46,-90.93 U$4.P$2
N$35
  Bottom 1.422: R20.2 13.46,-104.39 U$2.P$2
N$36
  Bottom 1.422: C3.1 15.49,-117.86 U$3.P$2
N$37
  Bottom 1.422: R22.2 U$1.P$2
N$38  (via drill 0.6 pad 2.54)
  other vias: 9.91,-98.55
N$39  (via drill 0.6 pad 2.54)
  other vias: 9.91,-85.09
N$40  (via drill 0.6 pad 2.54)
  other vias: 10.16,-71.63
N$41  (via drill 0.6 pad 2.54)
  other vias: 9.91,-111.76
N$42
  Bottom 1.016: R18.1 22.61,-77.22 23.88,-75.95 23.88,-69.85 24.89,-68.83 25.15,-69.09 C1.1
N$43
  Bottom 1.016: IC6.6 IC6.7 58.67,-60.71 59.44,-59.94 R41.2
N$44
  Bottom 1.016: R19.1 27.43,-84.59 C4.1
N$45
  Bottom 1.422: C5.1 24.13,-101.6 21.84,-103.89 R20.1
N$46
  Bottom 1.27: C6.1 25.65,-58.17 22.86,-60.96 R22.1
N$47
  Bottom 1.422: U$1.P$5 3.81,-64.01 | 4.06,-63.75 3.81,-64.01 | 3.81,-64.01 3.81,-57.15 6.6,-54.36 22.35,-54.36 26.92,-49.78 C7.1
N$48
  Bottom 1.016: R14.1 21.59,-67.56 22.1,-67.06 23.11,-67.06 25.65,-64.52 C8.1
N$49
  Bottom 1.016: R15.1 20.57,-82.04 20.57,-80.26 21.34,-79.5 23.37,-79.5 26.42,-76.45 C9.1
N$50
  Bottom 1.422: C10.2 22.1,-93.73 21.34,-93.98 R16.1
N$51
  Bottom 1.016: IC5.6 IC5.7 55.88,-73.66 63.75,-73.66 64.01,-73.91 R13.2
N$52
  Bottom 1.016: IC2.5 R25.1 66.55,-107.19 R29.1
N$53
  Bottom 1.422: R26.1 61.85,-104.65 | 61.85,-104.65 IC2.6 | R28.2 61.85,-104.65
N$54
  Bottom 1.016: R27.1 53.72,-114.05 IC3.7 57.66,-114.05
  Bottom 1.27: 57.66,-114.05 58.93,-114.05 59.94,-115.06 64.77,-115.06 66.55,-113.28 R31.2
N$55
  Bottom 1.016: 61.98,-101.35 62.23,-101.09 R32.2
  Bottom 1.422: IC2.7 58.93,-102.11 59.69,-101.35 61.98,-101.35 61.72,-101.6 R28.1
N$56
  Bottom 1.016: IC4.2 48.01,-86.11 | 48.01,-86.11 IC4.1 | R34.2 44.96,-85.09 45.97,-86.11 48.01,-86.11
N$57
  Bottom 1.422: C10.1 30.99,-91.44 C18.1 33.53,-91.44 35.31,-89.66 35.31,-86.87 R34.1
N$58
  Bottom 1.016: IC4.7 55.63,-87.88 | 55.63,-87.88 IC4.6 | R37.2 55.88,-88.14 55.63,-87.88
N$59
  Bottom 1.016: R24.2 41.4,-102.11 IC2.2 IC2.1
N$60
  Bottom 1.016: 48.01,-112.78 45.72,-112.78 42.42,-116.08 36.32,-116.08 R17.1 | 48.01,-112.78 IC3.1 | IC3.2 48.01,-112.78
N$61
  Bottom 1.016: R21.2 34.04,-119.89 34.04,-117.86 | 34.04,-117.86 33.27,-117.09 C16.2 | IC3.3 44.7,-116.59 43.43,-117.86 34.04,-117.86
N$62
  Bottom 1.422: C3.2 24.64,-116.33 27.69,-116.33 | 27.69,-116.33 26.16,-114.81 R17.2 | C16.1 27.69,-116.33
N$63
  Bottom 1.016: R23.2 39.12,-110.49 37.85,-109.22 37.85,-107.44 | 37.85,-107.44 37.85,-106.68 38.61,-105.92 40.64,-105.92 41.91,-104.65 IC2.3 | C17.2 37.85,-107.44
N$64
  Bottom 1.016: C11.2 23.37,-108.71 28.7,-108.71 30.1,-107.31 31.75,-107.31 31.88,-107.31 | R24.1 32,-107.19 31.88,-107.31 | C17.1 32.13,-107.31 31.88,-107.31
N$65
  Bottom 1.422: C5.2 39.88,-97.79 43.43,-96.77 45.97,-96.77 R33.1
N$66
  Bottom 1.016: R35.1 38.61,-87.88 38.23,-88.27 | 38.23,-88.27 37.85,-88.65 C18.2 | IC4.3 39.62,-89.66 38.23,-88.27
N$67
  Bottom 1.016: R37.1 67.82,-88.9 67.82,-92.71 66.04,-94.49 61.72,-94.49 | 61.72,-96.52 C21.2 61.72,-94.49 | R33.2 57.66,-95.76 58.93,-94.49 61.72,-94.49
N$68
  Bottom 1.016: IC4.5 61.98,-92.2 | 61.98,-92.2 65.02,-92.2 R36.2 | C21.1 61.72,-91.95 61.98,-92.2
N$69
  Bottom 1.016: IC2.8 55.88,-99.57 57.91,-99.57 58.42,-99.06 65.02,-99.06 65.15,-99.19 | 65.15,-99.19 66.04,-100.08 C12.2 | C19.2 IC4.8 53.09,-84.58 | IC7.8 55.12,-44.96 55.12,-44.83 C24.2 | IC6.8 55.88,-57.91 | 55.88,-57.91 59.69,-57.91 60.96,-56.64 C23.2 | 55.88,-57.91 55.63,-57.91 | 65.53,-98.81 65.15,-99.19 | 69.6,-67.56 65.79,-71.37 IC5.8
  Bottom 1.27: 56.01,-111.51 56.26,-111.63 | 53.09,-99.57 53.09,-111 53.67,-111.58 56.41,-111.58 | 53.09,-99.57 53.09,-84.58 53.09,-71.37 | 53.09,-71.37 53.09,-58.17 | 53.09,-58.17 53.09,-44.96 55.12,-44.96 | 55.88,-71.63 IC5.8 53.09,-71.37 | 55.63,-57.91 55.37,-58.17 53.09,-58.17 | 55.88,-99.57 53.09,-99.57 | C22.2 69.6,-65.91 69.6,-67.56
  Bottom 1.422: IC3.8 56.26,-111.63 56.41,-111.58 56.64,-111.51 C14.2
  Bottom 1.676: R54.1 65.53,-97.79 65.53,-98.81
N$70
  Bottom 1.016: IC7.5 58.67,-52.58 C28.2 62.99,-48.26 62.99,-44.2 R45.2
N$71
  Bottom 1.016: IC6.5 59.94,-65.79 | 59.94,-65.79 60.45,-65.79 C29.2 | R44.2 59.94,-64.26 59.94,-65.79
N$72
  Bottom 1.016: IC5.5 57.66,-78.99 59.94,-78.23 61.72,-78.23 | 68.33,-76.2 R43.2 64.52,-76.2 62.48,-78.23 61.72,-78.23 | C30.2 61.72,-78.23
N$73
  Bottom 1.016: R42.1 67.56,-46.48 65.79,-48.26 65.79,-50.04 | 65.79,-50.04 65.79,-51.31 63.75,-53.34 60.96,-53.34 58.93,-55.37 R40.1 | C28.1 65.79,-50.04
N$74
  Bottom 1.016: 47.5,-107.7 48.51,-107.7 IC2.4 | 50.55,-107.7 50.55,-119.13 IC3.4 | C20.1 45.09,-92.2 IC4.4 | C25.1 41.15,-51.31 45.21,-52.32 IC7.4
  Bottom 1.27: 50.55,-92.2 50.55,-107.7 48.51,-107.7 | 50.55,-92.2 50.55,-78.99 | 50.55,-78.99 50.55,-65.79 | 50.55,-65.79 50.55,-52.58 IC7.4 | IC6.4 50.55,-65.79 | IC5.4 50.55,-78.99 | IC4.4 50.55,-92.2
  Bottom 1.422: IC2.4 47.5,-107.7 C13.1 | IC3.4 46.23,-120.9 43.24,-120.9 | 43.18,-120.9 C15.1 | C27.1 43.82,-78.99 IC5.4 | C26.1 41.02,-65.28 42.42,-65.28 IC6.4
  Bottom 1.676: R55.1 43.24,-120.9 43.18,-120.9
N$75
  Bottom 1.016: C4.2 32.68,-82.8 44.7,-82.8 45.72,-81.79 R38.2
N$76
  Bottom 1.016: R39.2 44.96,-68.58 43.94,-67.56 33.53,-67.56 32.77,-68.33
  Bottom 1.422: C1.2 31.5,-69.6 32.77,-68.33
N$77
  Bottom 1.016: C6.2 32,-55.37 33.53,-53.85 43.69,-53.85 45.21,-55.37 R40.2
N$78
  Bottom 1.016: R39.1 58.67,-68.58 59.44,-69.34 64.77,-69.34 66.04,-68.07 C29.1 66.29,-66.55 66.29,-67.82 67.31,-66.8 67.31,-61.72 R41.1
N$79
  Bottom 1.016: R38.1 57.91,-81.79 C30.1 65.02,-81.03 R13.1
N$80
  Bottom 1.016: R51.2 45.21,-41.15 45.21,-45.47 47.24,-47.5 IC7.2 IC7.1
N$81
  Bottom 1.016: R50.2 42.67,-56.13 44.45,-57.91 44.45,-58.67 45.21,-59.44 47.5,-59.44 | 47.5,-59.44 47.5,-58.67 IC6.1 | IC6.2 48.01,-59.94 47.5,-59.44
N$82
  Bottom 1.422: IC5.2 46.74,-72.64 46.74,-72.14 | 46.74,-72.14 47.5,-71.37 IC5.1 | R49.2 44.96,-72.14 46.74,-72.14
N$83
  Bottom 1.27: R51.1 37.34,-41.91 36.96,-42.29 36.96,-43.81 C31.1
  Bottom 1.422: C31.1 37.34,-44.96 | 36.96,-42.29 32,-47.24 C7.2
N$84
  Bottom 1.016: C8.2 32,-62.74 34.54,-60.2 34.54,-59.44 | 34.54,-59.44 34.54,-56.39 R50.1 | C32.1 34.54,-59.44
N$85
  Bottom 1.422: C9.2 31.5,-73.15 34.42,-70.23 | 34.42,-70.23 34.8,-69.85 R49.1 | C33.1 35.81,-71.63 34.42,-70.23
N$86
  Bottom 1.016: R48.2 42.16,-47.5 42.8,-48.13 | 42.8,-48.13 44.7,-50.04 IC7.3 | C31.2 42.8,-44.58 42.8,-48.13
N$87
  Bottom 1.016: IC6.3 44.7,-63.25 43.31,-61.85 | 43.31,-61.85 41.4,-59.94 41.4,-59.18 C32.2 | R47.2 43.31,-61.85
N$88
  Bottom 1.422: R46.2 43.43,-76.45 | 43.43,-76.45 IC5.3 | C33.2 41.66,-73.15 43.43,-74.93 43.43,-76.45
N$89
  Bottom 1.676: IC1.2 67.06,-169.93 68.33,-168.66 R53.1
N$90
  Bottom 1.27: 88.39,-141.73 Q1.B 88.39,-144.78 88.65,-145.03 R70.1
N$91
  Bottom 1.016: 88.65,-151.89 88.65,-153.42 89.41,-154.18 89.41,-162.81 88.39,-163.83 X5.5 | 88.65,-151.89 R70.2 | R71.1 88.65,-151.89
N$92
  Bottom 1.27: 77.98,-109.98 76.45,-109.98 74.93,-111.51 74.93,-113.03 R31.1
  Bottom 1.422: 77.98,-109.98 84.07,-109.98 85.09,-111 K1.10
N$93
  Bottom 1.016: 75.31,-116.71 75.31,-116.97
  Bottom 1.27: R30.1 75.31,-116.97 75.69,-116.59 R58.2
  Bottom 1.422: 75.31,-116.71 78.49,-113.54 | 78.49,-113.54 79.5,-112.52 K1.8 | R60.2 73.66,-119.89 79.76,-113.79 79.76,-113.28 79.5,-113.54 78.49,-113.54
N$94
  Bottom 1.27: R29.2 75.95,-106.43 76.45,-105.92 R59.2
  Bottom 1.422: K1.5 78.99,-106.43 | 78.99,-106.43 75.95,-106.43 | 78.99,-106.43 78.99,-102.87 79.76,-102.11 R63.2
N$95
  Bottom 1.27: 76.45,-100.58 76.45,-100.33 80.26,-96.52 85.6,-96.52 86.11,-97.03 86.36,-97.03
  Bottom 1.422: R32.1 76.45,-100.58 | K1.3 85.09,-103.89 86.36,-102.62 86.36,-97.03
N$96
  Bottom 1.422: R3.1 71.51,-168.01 | 71.51,-168.01 73.93,-170.43 76.2,-170.43 77.98,-172.21 X5.1 | R65.2 71.51,-167.76 71.51,-168.01
N$97
  Bottom 1.422: R2.1 66.55,-189.99 68.33,-189.99 | 68.33,-189.99 69.85,-189.99 75.95,-183.9 75.95,-178.82 83.31,-177.04 X5.3 | R64.2 68.33,-190.88 68.33,-189.99
N$98
  Bottom 1.016: 92.71,-107.44 95.25,-109.98 95.25,-115.82 93.73,-118.62 93.73,-142.75 91.44,-150.88 91.44,-163.83 90.68,-164.59 90.68,-167.39 91.69,-168.4 | R62.2 82.3,-183.39 84.33,-185.42 87.63,-185.42 92.96,-180.09 92.96,-177.8 93.73,-177.04 93.73,-170.43 91.69,-168.4 | R61.2 91.93,-168.4 91.69,-168.4
  Bottom 1.27: 94.74,-105.41 93.98,-106.68 92.71,-106.68 | R74.1 92.71,-97.28 92.71,-103.38
  Bottom 1.422: K1.1 91.19,-107.44 92.71,-105.92 | 92.71,-105.92 92.71,-103.38 D1.C | 92.71,-107.44 92.71,-106.68 92.71,-105.92
N$99
  Bottom 1.016: K1.12 92.96,-114.81 91.69,-117.09 91.69,-138.94 Q1.C
  Bottom 1.422: K1.12 D1.A
N$100
  Bottom 1.422: X5.4 85.85,-178.82 85.6,-179.07 78.49,-180.85 78.49,-185.93 R52.1 77.72,-187.71 R66.2
N$101
  Bottom 1.422: R53.2 80,-168.41 | 80,-168.41 80.77,-169.19 X5.2 | R67.2 80,-167.78 80,-168.41
N$102  (via drill 0.6 pad 2.54)
  other vias: 81.03,-196.85
N$103  (via drill 0.6 pad 2.54)
  other vias: 87.38,-45.72
N$104
  Bottom 1.016: Q2.C 92.46,-185.17 92.46,-183.39 | 92.46,-183.39 95,-180.85 95,-178.82 95.76,-178.05 95.76,-166.88 96.52,-166.12 96.52,-160.27 93.73,-162.56 93.73,-164.85 94.47,-165.59 R61.1 94.47,-162.58 D2.C 95.25,-162.31 95.25,-165.61 95.5,-165.86 96.01,-165.86 96.01,-161.29 96.27,-161.04 R68.2 | 92.46,-183.39 R72.2
N$105
  Bottom 1.676: Q2.B 94.23,-188.47 | 87.63,-188.47 R75.1 Q2.B | 94.74,-188.47 Q2.B
N$106
  Bottom 1.676: 90.93,-171.2 X5.6 90.93,-176.02 89.66,-177.29 89.66,-178.05 | 89.66,-178.05 R75.2 | R76.1 87.38,-181.86 89.66,-179.58 89.66,-178.05
N$107
  Bottom 1.016: Q3.B 96.27,-155.7 95.25,-156.72 R68.1
N$108
  Bottom 1.27: X6.2 96.01,-193.29 97.28,-191.77 97.28,-183.9 96.9,-183.52 R72.1
N$109
  Bottom 1.27: K2.1 91.06,-81.15 | 91.06,-81.15 92.96,-83.06 R74.2 | D3.C 91.06,-76.83 91.06,-81.15
N$110
  Bottom 1.27: Q3.C 93.73,-151.38 96.01,-143.26 96.01,-119.38 97.54,-116.59 97.54,-94.49 95.76,-92.71 92.96,-92.71 92.2,-91.95 92.2,-89.15 91.19,-88.14 | K2.12 88.65,-85.6 91.19,-88.14 | D3.A 91.19,-86.87 91.19,-88.14
N$111  (via drill 0.6 pad 2.54)
  Bottom 1.27: IC9.8 141.99,-60.96 | 141.99,-60.96 128.27,-60.96 | 128.27,-60.96 IC8.8 | 141.99,-60.96 148.08,-60.96 v149.1,-61.98 C39.2 | C38.2 128.27,-60.96
N$112  (via drill 0.6 pad 2.54)
  Bottom 1.27: 134.37,-58.67 120.65,-58.67 IC8.4 119.51,-54.74 C36.1 | 134.37,-58.67 IC9.4 | IC9.4 134.37,-54.86 134.11,-54.86 134.11,-55.88 IC9.4 | 134.37,-58.67 148.08,-58.67 v149.1,-57.4 C37.1
N$113
  Bottom 1.27: R83.2 143.51,-54.86 | 143.51,-54.86 142.49,-55.88 IC9.1 | R86.1 143.76,-54.86 143.51,-54.86
N$114
  Bottom 1.27: R82.2 131.83,-51.31 130.05,-53.09 130.05,-55.88 | 130.05,-55.88 IC8.1 | 130.05,-55.88 R85.1
N$115
  Bottom 1.27: R94.1 125.48,-68.58 124.46,-67.56 124.46,-63.5 | 124.46,-63.5 IC8.6 | 124.46,-63.5 IC8.7
N$116
  Bottom 1.27: IC9.7 139.45,-68.33 141.22,-70.1 141.22,-73.66 140.72,-74.17 R93.1 R90.2
N$117
  Bottom 1.27: IC8.3 123.19,-53.09 118.87,-48.77 R77.1
N$118
  Bottom 1.27: R78.1 136.91,-48.77 IC9.3
N$119  (via drill 0.6 pad 3.81)
  Bottom 1.27: R78.2 129.79,-48.26 129.79,-45.72 | 129.79,-45.72 v129.79,-42.16 | 129.03,-45.72 R79.1 129.79,-45.72
N$120  (via drill 0.6 pad 3.81)
  Bottom 1.27: R77.2 123.95,-45.97 123.95,-45.72 | 123.95,-45.72 v123.95,-42.42 | R80.1 123.95,-45.72
N$121
  Bottom 1.27: R84.2 140.21,-50.04 139.45,-50.8 R83.1 IC9.2
N$122
  Bottom 1.27: R81.1 124.97,-51.31 125.73,-51.31 | 125.73,-51.31 R82.1 | IC8.2 125.73,-51.31
N$123
  Bottom 1.27: IC9.6 137.16,-63.75 137.16,-71.37 | 137.16,-71.37 R88.2 136.4,-71.12 136.65,-70.87 133.6,-70.87 R90.1 | 137.16,-71.37 137.41,-71.12 R89.2
N$124
  Bottom 1.27: K2.10 83.57,-86.87 83.06,-87.38 R87.2
N$125
  Bottom 1.27: IC8.5 119.13,-65.02 R91.1
N$126  (via drill 0.6 pad 3.81)
  Bottom 1.27: R92.1 109.73,-67.82 109.73,-64.77 | 109.73,-64.77 v109.73,-61.47 | R91.2 110.24,-64.77 109.73,-64.77
N$127
  Bottom 1.27: R95.1 IC9.5
N$128
  Bottom 1.27: R86.2 147.32,-66.04 147.32,-70.61 | 147.32,-70.61 146.81,-71.12 R89.1 | C41.+ 147.32,-70.61
N$129
  Bottom 1.27: R85.2 131.32,-68.83 R88.1 124.97,-71.37 C42.+
N$130
  Bottom 1.27: C40.+ 120.14,-70.87 R94.2
N$131  (via drill 0.6 pad 3.81)
  Bottom 1.27: v148.34,-77.72 147.83,-77.22 R93.2
N$132
  Bottom 1.27: C40.- 113.54,-76.2 113.67,-76.33 | 113.67,-76.33 116.33,-79.25 125.98,-79.25 127.25,-80.52 X7.1 | R96.2 111.25,-78.74 113.67,-76.33
N$133
  Bottom 1.27: C41.- 153.92,-71.37 154.18,-71.63 154.18,-80.26 152.4,-82.04 | X7.5 139.45,-83.57 150.88,-83.57 152.4,-82.04 | R97.2 152.4,-82.04
N$134
  Bottom 1.27: C42.- 127.51,-75.95 R98.2 128.78,-76.96 129.79,-77.98 X7.2
N$136  (via drill 0.6 pad 1.68)
  other vias: 19.56,-48.77
N$137  (via drill 0.6 pad 1.68)
  other vias: 75.69,-71.88
TOVOLL  (via drill 0.6 pad 2.54)
  Bottom 1.27: K2.3 86.11,-81.28 86.11,-86.87 89.66,-90.42 89.66,-96.27 88.9,-97.03 88.9,-103.89 87.63,-105.16 87.63,-116.59 86.87,-117.35 81.28,-117.35
  Bottom 1.422: v80.52,-117.86 80.26,-117.86 | 80.26,-117.86 79.76,-117.86 77.72,-119.89 77.72,-120.14 78.49,-120.14 81.28,-117.35 82.55,-116.08 81.79,-116.08 80.26,-117.6 80.26,-117.86 | 80.26,-117.86 82.55,-115.57 K1.9
TOVOLR  (via drill 0.6 pad 2.54)
  Bottom 1.27: R87.1 v83.06,-101.35
  Bottom 1.422: v83.06,-101.35 82.55,-101.85 K1.4
V+  (via drill 0.6 pad 2.54)
  Bottom 1.676: v76.96,-143.26 76.2,-143.26 75.18,-142.24 R56.1
V++  (via drill 0.6 pad 2.54)
  Bottom 1.27: R54.2 73.66,-98.81 73.66,-105.16 72.14,-106.68 72.14,-116.59 69.85,-118.87 69.85,-121.92 74.3,-126.36 75.06,-125.86
  Bottom 1.422: v71.12,-125.73 72.52,-127.13 73.79,-127.13
  Bottom 1.676: C34.+ 71.88,-129.03 73.79,-127.13 75.06,-125.86 75.06,-124.59 R56.2
V-  (via drill 0.6 pad 2.54)
  Bottom 1.676: v76.96,-158.5 74.68,-156.21 74.68,-149.61 80.26,-149.61 80.26,-140.46 78.74,-138.94 R57.1
V--  (via drill 0.6 pad 2.54)
  Bottom 1.27: R55.2 57.51,-132.33 70.61,-132.33 71.37,-131.57 73.15,-131.57 75.95,-128.78 76.71,-128.78 78.74,-126.75 78.74,-125.48 | R57.2 78.74,-124.21
  Bottom 1.422: v86.87,-127.76 82.3,-127.51 81.18,-127.61 81.13,-127.61 | 81,-127.61 81.13,-127.61 | 81.13,-127.61 83.19,-129.67
  Bottom 1.676: R57.2 78.74,-125.22 | 78.74,-125.22 78.74,-125.48 | C35.- 84.58,-131.06 83.19,-129.67 78.74,-125.22
(copper drawn outside any net)
  shapes: Bottom area x312, Bottom circle x12

### Text on the board
Bottom: BEN PROVENZANO III